# Altium project DRV8432有刷直流电机驱动.PrjPCB
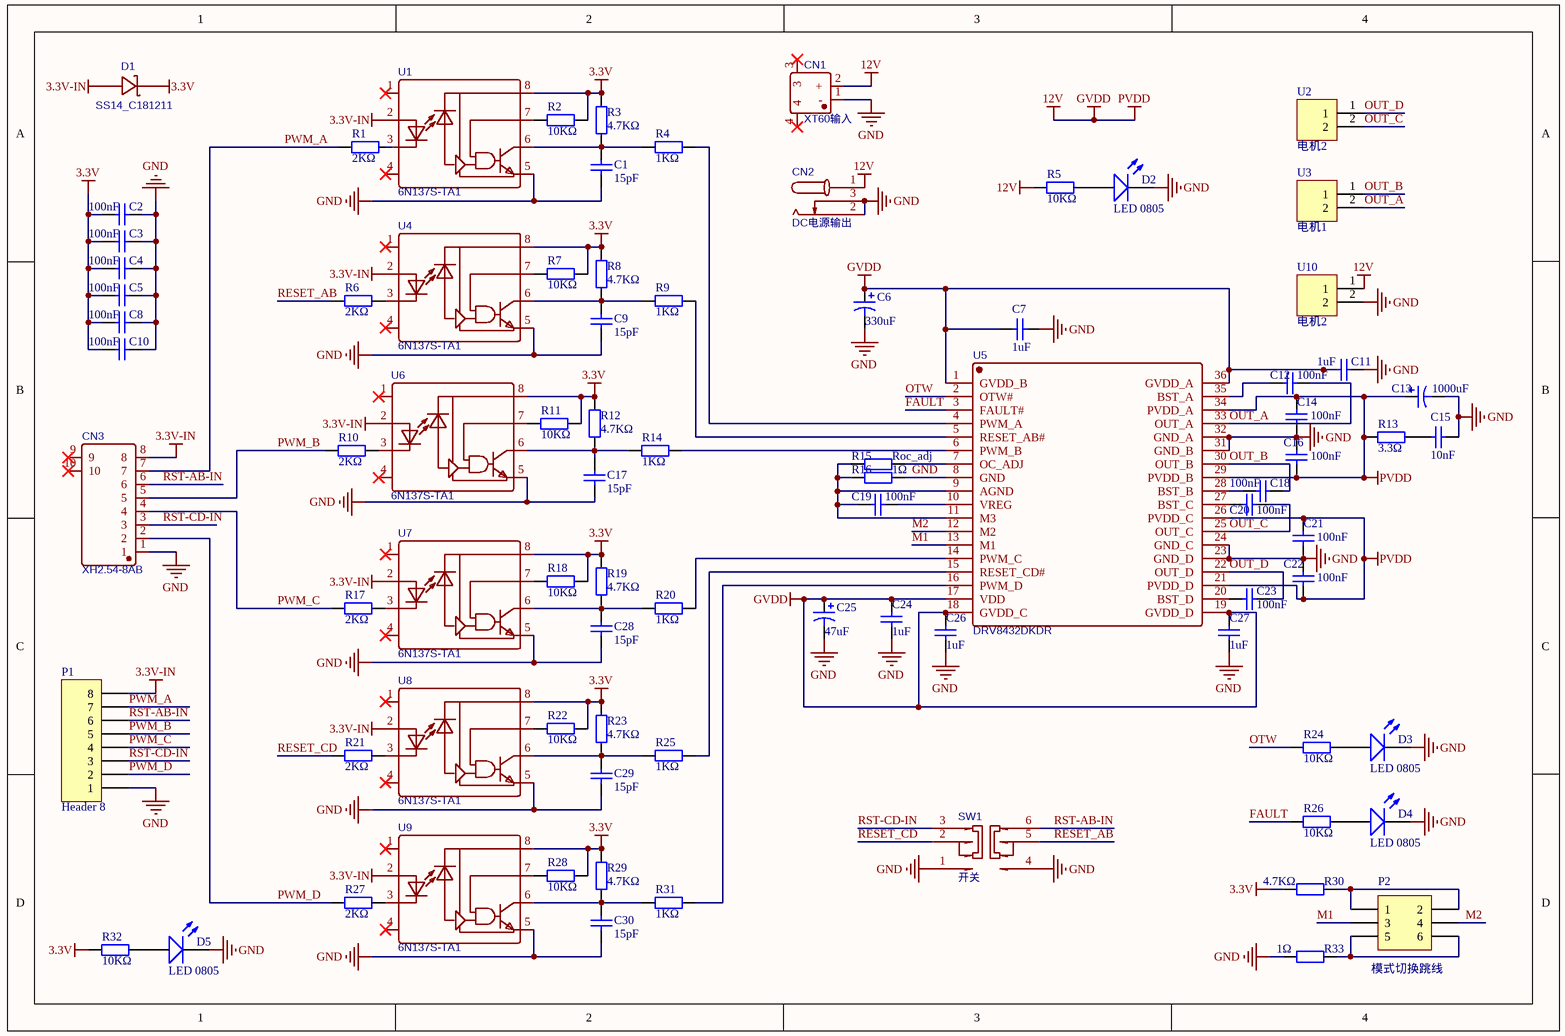
[diagram p0: DRV8432有刷直流电机驱动.SchDoc]
1 sheet, 84 parts. Net scope: global (net labels, ports and power ports of the same name join across sheets).
Board file: DRV8432有刷直流电机驱动.PcbDoc

## Sheet DRV8432有刷直流电机驱动.SchDoc
size A4

### Parts
C1  15pF  [0805_C]
C2  100nF  [0805_C]
C3  100nF  [0805_C]
C4  100nF  [0805_C]
C5  100nF  [0805_C]
C6  value 330uF  [CAP-TH_BD8.0-P3.50-D0.6-FD]  (hidden comment: Cap Pol1)
C7  1uF  [0805_C]
C8  100nF  [0805_C]
C9  15pF  [0805_C]
C10  100nF  [0805_C]
C11  1uF  [0805_C]
C12  100nF  [0805_C]
C13  value 1000uF  [CAP-TH_BD25.0-P10.00-D2.3-FD]  (hidden comment: Cap Pol1)
C14  100nF  [0805_C]
C15  10nF  [0805_C]
C16  100nF  [0805_C]
C17  15pF  [0805_C]
C18  100nF  [0805_C]
C19  100nF  [0805_C]
C20  100nF  [0805_C]
C21  100nF  [0805_C]
C22  100nF  [0805_C]
C23  100nF  [0805_C]
C24  1uF  [0805_C]
C25  value 47uF  [CAP-TH_BD5.0-P2.00-D0.8-FD]  (hidden comment: Cap Pol1)
C26  1uF  [0805_C]
C27  1uF  [0805_C]
C28  15pF  [0805_C]
C29  15pF  [0805_C]
C30  15pF  [0805_C]
CN1  XT60输入  [XT60座子]
CN2  DC电源输出  [DC接口5.5*2.1]
CN3  XH2.54-8AB  [CONN-SMD_8P-P2.54_XH2.54-8AB]
D1  SS14_C181211  [SMA_L4.4-W2.8-LS5.4-RD]
D2  LED 0805  [0805_LED_S1]
D3  LED 0805  [0805_LED_S1]
D4  LED 0805  [0805_LED_S1]
D5  LED 0805  [0805_LED_S1]
P1  Header 8  [HDR1X8]
P2  模式切换跳线  [HDR2X3]
R1  2KΩ  [0805_R]
R2  10KΩ  [0805_R]
R3  4.7KΩ  [0805_R]
R4  1KΩ  [0805_R]
R5  10KΩ  [0805_R]
R6  2KΩ  [0805_R]
R7  10KΩ  [0805_R]
R8  4.7KΩ  [0805_R]
R9  1KΩ  [0805_R]
R10  2KΩ  [0805_R]
R11  10KΩ  [0805_R]
R12  4.7KΩ  [0805_R]
R13  3.3Ω  [0805_R]
R14  1KΩ  [0805_R]
R15  Roc_adj  [0805_R]
R16  1Ω  [0805_R]
R17  2KΩ  [0805_R]
R18  10KΩ  [0805_R]
R19  4.7KΩ  [0805_R]
R20  1KΩ  [0805_R]
R21  2KΩ  [0805_R]
R22  10KΩ  [0805_R]
R23  4.7KΩ  [0805_R]
R24  10KΩ  [0805_R]
R25  1KΩ  [0805_R]
R26  10KΩ  [0805_R]
R27  2KΩ  [0805_R]
R28  10KΩ  [0805_R]
R29  4.7KΩ  [0805_R]
R30  4.7KΩ  [0805_R]
R31  1KΩ  [0805_R]
R32  10KΩ  [0805_R]
R33  1Ω  [0805_R]
SW1  开关  [贴片6P拨动开关]
U1  6N137S-TA1  [SOP-8_L9.8-W6.6-P2.54-LS10.3-BL]
U2  电机2  [2Pin大接线端子]
U3  电机1  [2Pin大接线端子]
U4  6N137S-TA1  [SOP-8_L9.8-W6.6-P2.54-LS10.3-BL]
U5  DRV8432DKDR  [HSSOP-36_L16.0-W11.0-P0.65-LS14.2-BL]
U6  6N137S-TA1  [SOP-8_L9.8-W6.6-P2.54-LS10.3-BL]
U7  6N137S-TA1  [SOP-8_L9.8-W6.6-P2.54-LS10.3-BL]
U8  6N137S-TA1  [SOP-8_L9.8-W6.6-P2.54-LS10.3-BL]
U9  6N137S-TA1  [SOP-8_L9.8-W6.6-P2.54-LS10.3-BL]
U10  电机2  [2Pin大接线端子]

### Nets
3.3V: C2.2 C3.2 C4.2 C5.2 C8.2 C10.2 D1.1(K) R2.2 R3.2 R7.2 R8.2 R11.2 R12.2 R18.2 R19.2 R22.2 R23.2 R28.2 R29.2 R30.2 R32.1 U1.8 U4.8 U6.8 U7.8 U8.8 U9.8
3.3V-IN: CN3.8 D1.2(A) P1.8 U1.2 U4.2 U6.2 U7.2 U8.2 U9.2
12V: C6.1 C7.1 C11.2 C13.1 C14.2 C16.1 C21.2 C22.1 C24.2 C25.1 C26.2 C27.2 CN1.2(+) CN2.1 R5.1 R13.1 U5.1(GVDD_B) U5.17(VDD) U5.18(GVDD_C) U5.19(GVDD_D) U5.21(PVDD_D) U5.26(PVDD_C) U5.29(PVDD_B) U5.34(PVDD_A) U5.36(GVDD_A) U10.1  [also labelled GVDD, PVDD]
GND: C1.1 C2.1 C3.1 C4.1 C5.1 C6.2 C7.2 C8.1 C9.1 C10.1 C11.1 C13.2 C14.1 C15.2 C16.2 C17.1 C21.1 C22.2 C24.1 C25.2 C26.1 C27.1 C28.1 C29.1 C30.1 CN1.1(-) CN2.2 CN2.3 CN3.1 D2.K D3.K D4.K D5.K P1.1 R16.1 R33.2 SW1.1 SW1.4 U1.5 U4.5 U5.8(GND) U5.23(GND_D) U5.24(GND_C) U5.31(GND_B) U5.32(GND_A) U6.5 U7.5 U8.5 U9.5 U10.2
FAULT: R26.1 U5.3(FAULT#)
M1: P2.3 U5.13(M1)
M2: P2.4 U5.12(M2)
OTW: R24.1 U5.2(OTW#)
OUT_A: C12.2 U3.2 U5.33(OUT_A)
OUT_B: C18.2 U3.1 U5.30(OUT_B)
OUT_C: C20.2 U2.2 U5.25(OUT_C)
OUT_D: C23.1 U2.1 U5.22(OUT_D)
PWM_A: CN3.7 P1.7 R1.1
PWM_B: CN3.5 P1.5 R10.1
PWM_C: CN3.4 P1.4 R17.1
PWM_D: CN3.2 P1.2 R27.1
RESET_AB: R6.1 SW1.5
RESET_CD: R21.1 SW1.2
RST-AB-IN: CN3.6 P1.6 SW1.6
RST-CD-IN: CN3.3 P1.3 SW1.3
NetC1_2: C1.2 R3.1 R4.1 U1.6
NetC9_2: C9.2 R8.1 R9.1 U4.6
NetC12_1: C12.1 U5.35(BST_A)
NetC15_1: C15.1 R13.2
NetC17_2: C17.2 R12.1 R14.1 U6.6
NetC18_1: C18.1 U5.28(BST_B)
NetC19_1: C19.1 R15.2 R16.2 U5.9(AGND) U5.11(M3)
NetC19_2: C19.2 U5.10(VREG)
NetC20_1: C20.1 U5.27(BST_C)
NetC23_2: C23.2 U5.20(BST_D)
NetC28_2: C28.2 R19.1 R20.1 U7.6
NetC29_2: C29.2 R23.1 R25.1 U8.6
NetC30_2: C30.2 R29.1 R31.1 U9.6
NetD2_A: D2.A R5.2
NetD3_A: D3.A R24.2
NetD4_A: D4.A R26.2
NetD5_A: D5.A R32.2
NetP2_1: P2.1 P2.2 R30.1
NetP2_5: P2.5 P2.6 R33.1
NetR1_2: R1.2 U1.3
NetR2_1: R2.1 U1.7
NetR4_2: R4.2 U5.4(PWM_A)
NetR6_2: R6.2 U4.3
NetR7_1: R7.1 U4.7
NetR9_2: R9.2 U5.5(RESET_AB#)
NetR10_2: R10.2 U6.3
NetR11_1: R11.1 U6.7
NetR14_2: R14.2 U5.6(PWM_B)
NetR15_1: R15.1 U5.7(OC_ADJ)
NetR17_2: R17.2 U7.3
NetR18_1: R18.1 U7.7
NetR20_2: R20.2 U5.14(PWM_C)
NetR21_2: R21.2 U8.3
NetR22_1: R22.1 U8.7
NetR25_2: R25.2 U5.15(RESET_CD#)
NetR27_2: R27.2 U9.3
NetR28_1: R28.1 U9.7
NetR31_2: R31.2 U5.16(PWM_D)

Not connected (* = marked no-connect by the designer): CN1 3* 4*; CN3 9* 10*; U1 1* 4*; U4 1* 4*; U6 1* 4*; U7 1* 4*; U8 1* 4*; U9 1* 4*

### Library data of the parts
C1 C9 C17 C28-C30 = 0805 15pF (150) 5% 50V: 贴片电容; ComponentLink1Description: 供应商链接; ComponentLink1URL: http://www.szlcsc.com/product/details_2146.html; Package: 0805; Supplier: LC; SuppliersPartNumber: C1794
C2-C5 C8 C10 C12 C14 C16 C18-C23 = 0805 100nF(104) 10% 50V: 贴片电容; ComponentLink1Description: 供应商链接; ComponentLink1URL: http://www.szlcsc.com/product/details_50686.html; Package: 0805; Supplier: LC; SuppliersPartNumber: C49678
C6 C13 C25 = Cap Pol1: Polarized Capacitor (Radial); Published: 8-Jun-2000; LatestRevisionDate: 17-Jul-2002; LatestRevisionNote: Re-released for DXP Platform.; PackageReference: RB7.6-15; Publisher: Altium Limited; PackageDescription: Polarized Capacitor (Radial); 2 Leads
C7 C11 C24 C26 C27 = 0805 1uF (105) 10% 50V: 贴片电容; ComponentLink1Description: 供应商链接; ComponentLink1URL: http://www.szlcsc.com/product/details_29074.html; Package: 0805; Supplier: LC; SuppliersPartNumber: C28323
C15 = 0805 10nF (103) 10% 50V: 贴片电容; ComponentLink1Description: 供应商链接; ComponentLink1URL: http://www.szlcsc.com/product/details_2062.html; Package: 0805; Supplier: LC; SuppliersPartNumber: C1710
CN1 = XT60: BOM_Manufacturer: AMASS(艾迈斯); BOM_Manufacturer Part: XT60PW-M; Contributor: LCSC; BOM_Supplier: LCSC; BOM_Supplier Part: C98732; BOM_JLCPCB Part Class: Extended Part; spicePre: C; spiceSymbolName: XT60PW-M
CN2 = DC接口2251: BOM_Manufacturer: HRO; BOM_Manufacturer Part: DC-005-20A; Contributor: LCSC; BOM_Supplier: LCSC; BOM_Supplier Part: C136744; BOM_JLCPCB Part Class: Extended Part; spicePre: D; spiceSymbolName: DC-005-20A_C136744
CN3 = XH2.54-8AB: BOM_Manufacturer: Boom Precision Elec; Contributor: LCSC; BOM_Supplier: LCSC; BOM_Supplier Part: C146131; BOM_Manufacturer Part: -; BOM_JLCPCB Part Class: Extended Part; spicePre: C; spiceSymbolName: XH2.54-8AB
D1 = SS14_C181211: BOM_Manufacturer: Hottech; BOM_Manufacturer Part: SS14; Contributor: LCSC; BOM_Supplier: LCSC; BOM_Supplier Part: C181211; BOM_JLCPCB Part Class: Extended Part; spicePre: D; spiceSymbolName: SS14_C181211
D2-D5 = 0805 白灯: 发光二极管; ComponentLink1Description: 供应商链接; ComponentLink1URL: http://www.szlcsc.com/product/details_35468.html; Package: 0805; Supplier: LC; SuppliersPartNumber: C34499
P1 = Header 8: Header, 8-Pin; LatestRevisionDate: 17-Jul-2002; LatestRevisionNote: Re-released for DXP Platform.; Publisher: Altium Limited
P2 = Header 3X2: Header, 3-Pin, Dual row; LatestRevisionDate: 17-Jul-2002; LatestRevisionNote: Re-released for DXP Platform.; Publisher: Altium Limited
R1 R6 R10 R17 R21 R27 = 0805 2KΩ (2001) 1%: 贴片电阻; ComponentLink1Description: 供应商链接; ComponentLink1URL: http://www.szlcsc.com/product/details_18292.html; Package: 0805; Supplier: LC; SuppliersPartNumber: C17604
R2 R5 R7 R11 R18 R22 R24 R26 R28 R32 = 0805 10KΩ (1002) 1%: 贴片电阻; ComponentLink1Description: 供应商链接; ComponentLink1URL: http://www.szlcsc.com/product/details_18102.html; Package: 0805; Supplier: LC; SuppliersPartNumber: C17414
R3 R8 R12 R19 R23 R29 R30 = 0805 4.7KΩ (4701) 1%: 贴片电阻; ComponentLink1Description: 供应商链接; ComponentLink1URL: http://www.szlcsc.com/product/details_18361.html; Package: 0805; Supplier: LC; SuppliersPartNumber: C17673
R4 R9 R14 R20 R25 R31 = 0805 1KΩ (1001) 1%: 贴片电阻; ComponentLink1Description: 供应商链接; ComponentLink1URL: http://www.szlcsc.com/product/details_18201.html; Package: 0805; Supplier: LC; SuppliersPartNumber: C17513
R13 = 0805 3.3KΩ (3301) 1%: 贴片电阻; ComponentLink1Description: 供应商链接; ComponentLink1URL: http://www.szlcsc.com/product/details_26753.html; Package: 0805; Supplier: LC; SuppliersPartNumber: C26010
R15 R16 R33 = 0805 1Ω (1R00) 1%: 贴片电阻; ComponentLink1Description: 供应商链接; ComponentLink1URL: http://www.szlcsc.com/product/details_26014.html; Package: 0805; Supplier: LC; SuppliersPartNumber: C25271
SW1 = 6P拨动开关: BOM_Manufacturer: XKB Enterprise; BOM_Manufacturer Part: SS-3235S-L3; Contributor: LCSC; BOM_Supplier: LCSC; BOM_Supplier Part: C381098; BOM_JLCPCB Part Class: Extended Part; spicePre: S; spiceSymbolName: SS-3235S-L3
U1 U4 U6-U9 = 6N137S-TA1: BOM_Manufacturer: LITEON; BOM_Supplier: LCSC; BOM_Manufacturer Part: 6N137S-TA1; BOM_Supplier Part: C92651; BOM_JLCPCB Part Class: Extended Part; spicePre: U; spiceSymbolName: 6N137S-TA1
U2 U3 U10 = 接线端子
U5 = DRV8432DKDR: BOM_Manufacturer: TI; BOM_Supplier: LCSC; BOM_Manufacturer Part: DRV8432DKDR; BOM_Supplier Part: C79853; BOM_JLCPCB Part Class: Extended Part; spicePre: U; spiceSymbolName: DRV8432DKDR